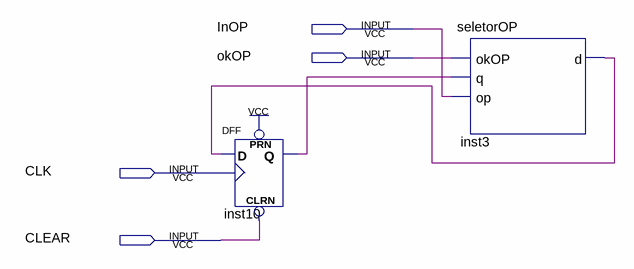
[diagram p0: schematic sheet]
// Quartus schematic memop.bdf as structural Verilog: 2 symbols, 4 pins
module memop (
  input  InOP,
  input  okOP,
  input  CLK,
  input  CLEAR
);

  wire inst3_d, inst10_q;

  DFF inst10 (.CLRN(CLEAR), .CLK(CLK), .D(inst3_d), .PRN(1'b1), .Q(inst10_q));
  seletorOP inst3 (.okOP(okOP), .q(inst10_q), .op(InOP), .d(inst3_d));
endmodule
